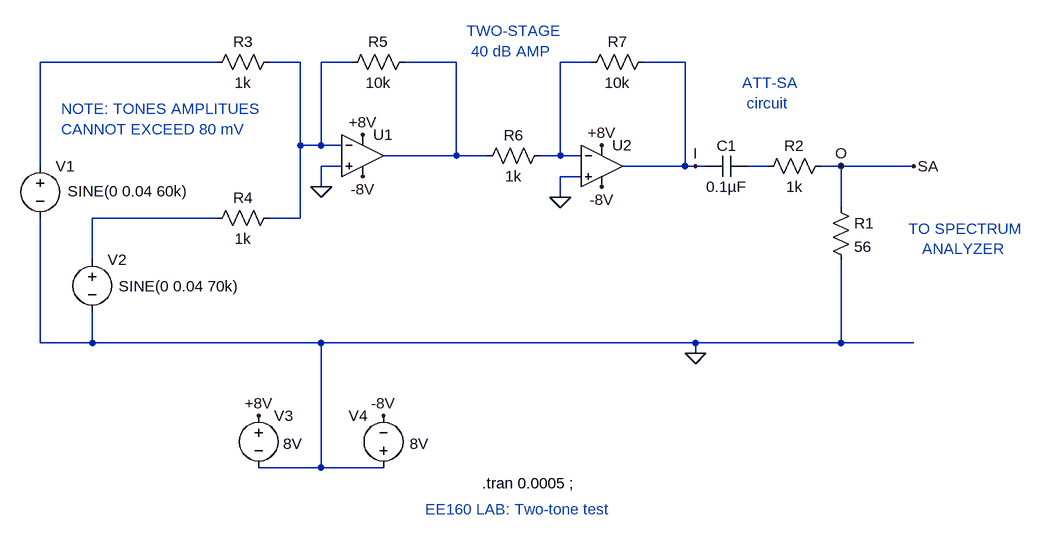
[diagram p0: schematic EE160_two_tone_test.asc]
EE160_two_tone_test.asc, the LTspice schematic file:
Version 4
SHEET 1 928 688
WIRE -304 -16 -576 -16
WIRE -176 -16 -224 -16
WIRE -96 -16 -144 -16
WIRE 64 -16 -16 -16
WIRE 272 -16 224 -16
WIRE 416 -16 352 -16
WIRE -176 112 -176 -16
WIRE -144 112 -144 -16
WIRE -144 112 -176 112
WIRE -112 112 -144 112
WIRE 64 128 64 -16
WIRE 64 128 -48 128
WIRE 112 128 64 128
WIRE 224 128 224 -16
WIRE 224 128 192 128
WIRE 256 128 224 128
WIRE -576 144 -576 -16
WIRE -112 144 -144 144
WIRE 416 144 416 -16
WIRE 416 144 320 144
WIRE 432 144 416 144
WIRE 448 144 432 144
WIRE 544 144 512 144
WIRE 656 144 624 144
WIRE 768 144 656 144
WIRE 256 160 224 160
WIRE -144 176 -144 144
WIRE 224 192 224 160
WIRE 656 208 656 144
WIRE -304 224 -496 224
WIRE -176 224 -176 112
WIRE -176 224 -224 224
WIRE -496 288 -496 224
WIRE -576 416 -576 224
WIRE -496 416 -496 368
WIRE -496 416 -576 416
WIRE -144 416 -496 416
WIRE 432 416 -144 416
WIRE 656 416 656 288
WIRE 656 416 432 416
WIRE 768 416 656 416
WIRE 432 432 432 416
WIRE -144 608 -144 416
WIRE -144 608 -240 608
WIRE -48 608 -144 608
FLAG 432 432 0
FLAG 656 144 O
FLAG 432 144 I
FLAG -240 528 +8V
FLAG -48 528 -8V
FLAG -80 96 +8V
FLAG 288 112 +8V
FLAG -80 160 -8V
FLAG 288 176 -8V
FLAG -144 176 0
FLAG 224 192 0
FLAG 768 144 SA
SYMBOL voltage -576 128 R0
WINDOW 123 24 124 Left 2
WINDOW 39 0 0 Left 2
WINDOW 3 42 55 Left 2
SYMATTR Value SINE(0 0.04 60k)
SYMATTR InstName V1
SYMBOL cap 448 160 R270
WINDOW 0 32 32 VTop 2
WINDOW 3 0 32 VBottom 2
SYMATTR InstName C1
SYMATTR Value 0.1µF
SYMBOL res 640 192 R0
SYMATTR InstName R1
SYMATTR Value 56
SYMBOL res 528 160 R270
WINDOW 0 32 56 VTop 2
WINDOW 3 0 56 VBottom 2
SYMATTR InstName R2
SYMATTR Value 1k
SYMBOL OpAmps\\UniversalOpamp -80 128 R0
SYMATTR InstName U1
SYMBOL OpAmps\\UniversalOpamp 288 144 R0
SYMATTR InstName U2
SYMBOL res -208 -32 R90
WINDOW 0 0 56 VBottom 2
WINDOW 3 32 56 VTop 2
SYMATTR InstName R3
SYMATTR Value 1k
SYMBOL res -208 208 R90
WINDOW 0 0 56 VBottom 2
WINDOW 3 32 56 VTop 2
SYMATTR InstName R4
SYMATTR Value 1k
SYMBOL res 0 -32 R90
WINDOW 0 0 56 VBottom 2
WINDOW 3 32 56 VTop 2
SYMATTR InstName R5
SYMATTR Value 10k
SYMBOL res 208 112 R90
WINDOW 0 0 56 VBottom 2
WINDOW 3 32 56 VTop 2
SYMATTR InstName R6
SYMATTR Value 1k
SYMBOL res 368 -32 R90
WINDOW 0 0 56 VBottom 2
WINDOW 3 32 56 VTop 2
SYMATTR InstName R7
SYMATTR Value 10k
SYMBOL voltage -496 272 R0
WINDOW 123 24 124 Left 2
WINDOW 39 0 0 Left 2
WINDOW 3 41 57 Left 2
SYMATTR Value SINE(0 0.04 70k)
SYMATTR InstName V2
SYMBOL voltage -240 512 R0
WINDOW 3 38 59 Left 2
WINDOW 123 0 0 Left 0
WINDOW 39 0 0 Left 0
SYMATTR Value 8V
SYMATTR InstName V3
SYMBOL voltage -48 624 R180
WINDOW 0 24 96 Left 2
WINDOW 3 -70 53 Left 2
WINDOW 123 0 0 Left 0
WINDOW 39 0 0 Left 0
SYMATTR InstName V4
SYMATTR Value 8V
TEXT 104 632 Left 2 !.tran 0.0005 ;
TEXT 760 240 Left 2 ;TO SPECTRUM\n   ANALYZER
TEXT 80 -64 Left 2 ;TWO-STAGE\n 40 dB AMP
TEXT 16 672 Left 2 ;EE160 LAB: Two-tone test
TEXT -544 56 Left 2 ;NOTE: TONES AMPLITUES \nCANNOT EXCEED 80 mV
TEXT 504 16 Left 2 ;ATT-SA\n circuit

The netlist it stands for:
* EE160_two_tone_test.asc
V1 N001 0 SINE(0 0.04 60k)
C1 I N005 0.1µF
R1 SA 0 56
R2 N005 SA 1k
XU1 0 N002 +8V -8V N003 level1 Avol=1Meg GBW=10Meg Vos=0 En=0 Enk=0 In=0 Ink=0 Rin=500Meg  ; pins In+ In- V+ V- OUT
XU2 0 N004 +8V -8V I level1 Avol=1Meg GBW=10Meg Vos=0 En=0 Enk=0 In=0 Ink=0 Rin=500Meg  ; pins In+ In- V+ V- OUT
R3 N002 N001 1k
R4 N002 N006 1k
R5 N003 N002 10k
R6 N004 N003 1k
R7 I N004 10k
V2 N006 0 SINE(0 0.04 70k)
V3 +8V 0 8V
V4 0 -8V 8V
.tran 0.0005 ;
* TO SPECTRUM
*    ANALYZER
* TWO-STAGE
*  40 dB AMP
* EE160 LAB: Two-tone test
* NOTE: TONES AMPLITUES
* CANNOT EXCEED 80 mV
* ATT-SA
*  circuit
.lib UniversalOpAmp1.lib
.backanno
.end